# EAGLE design rotary-encoder-breakout-mk-1.0 (EAGLE 6.5.0)
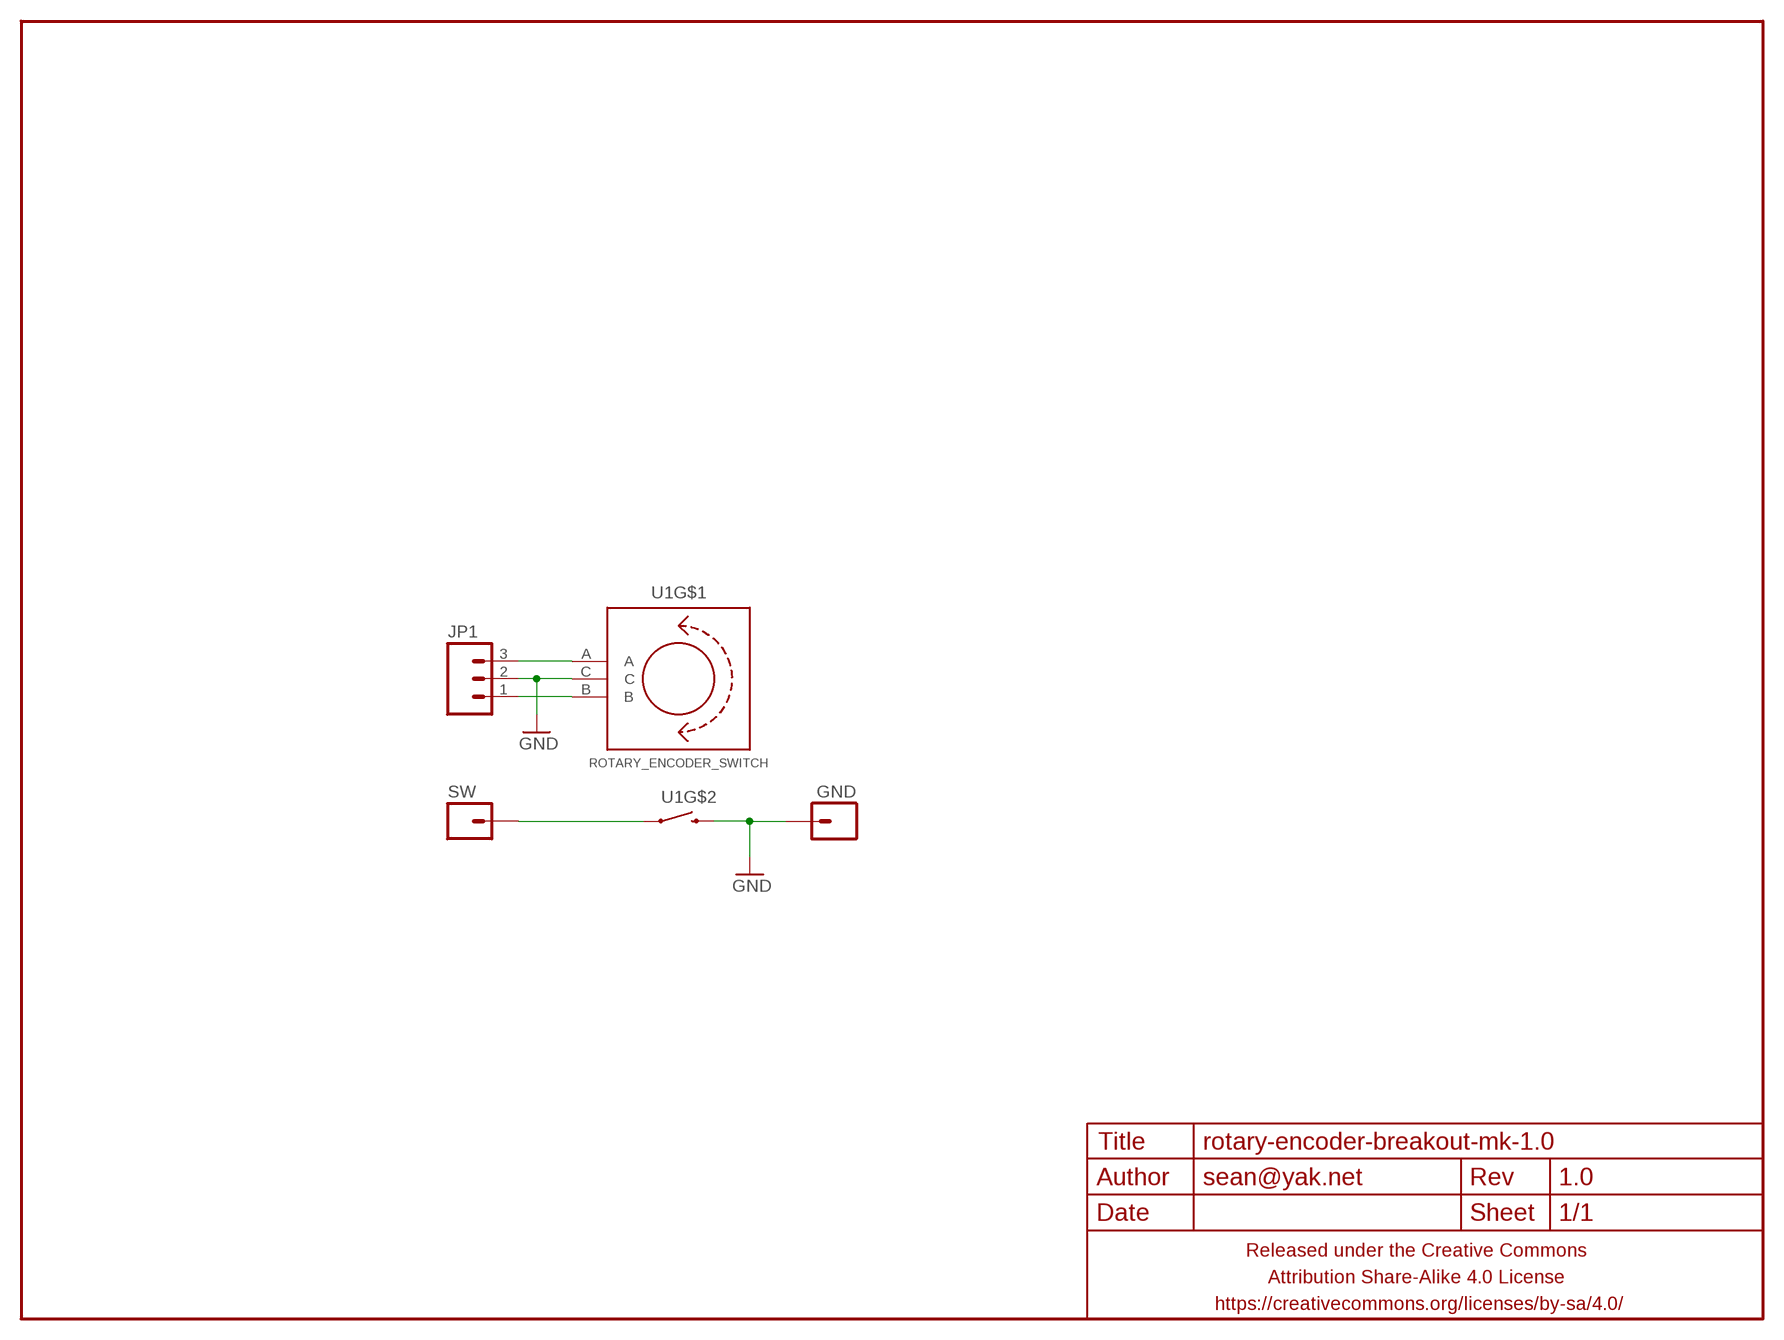
[diagram p0: schematic, sheet 1]

## Parts
FRAME1  FRAME-LETTERNO_PACKAGE  [DUMMY]
GND  M01PTH  [1X01]
JP1  M03PTH  [1X03]
SW  M01PTH  [1X01]
U1  ROTARY_ENCODER_SWITCH  [ROTARY_ENCODER_SWITCH]

## Nets
GND: GND.1 JP1.2 U1.C U1.SW2
N$1: JP1.3 U1.A
N$2: JP1.1 U1.B
SW1: SW.1 U1.SW1

## Library data of the parts
FRAME1 = A_butts:FRAME-LETTER: Schematic Frame Standard 8.5x11 US Letter frame; DESIGNER: sean@yak.net; VERSION: 1.0
GND SW = A_butts:M01: Header 1 Standard 1-pin 0.1" header. Use with straight break away headers (SKU : PRT-00116), right angle break away headers (PRT-00553), swiss pins (PRT-00743), machine pins (PRT-00117), and female headers (PRT-00115).
JP1 = A_butts:M03: Header 3 Standard 3-pin 0.1" header. Use with straight break away headers (SKU : PRT-00116), right angle break away headers (PRT-00553), swiss pins (PRT-00743), machine pins (PRT-00117), and female headers (PRT-00115). Molex polarized connector foot print use with SKU : PRT-08232 with associated crimp pins and housings.
U1 = A_butts:ROTARY_ENCODER_SWITCH

## Board
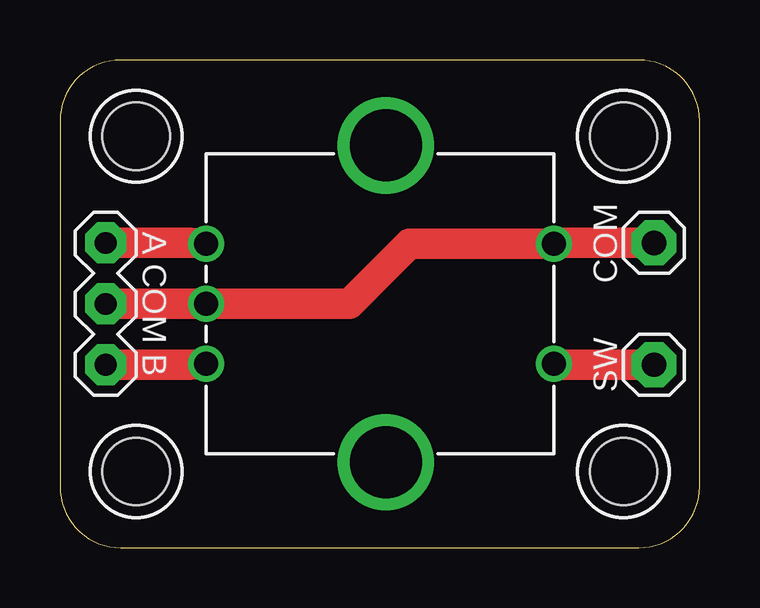
[diagram p1: board, top side]

Size 26.67 x 20.32 mm. Coordinates in mm from the lower left corner, seen from the top.
Outline: 0,17.78 0,2.54 arc90 2.54,0 24.13,0 arc90 26.67,2.54 26.67,17.78 arc90 24.13,20.32 2.54,20.32 arc90 0,17.78
Copper layers (1*16): Top 0.0356mm / dielectric 1.5011mm / Bottom 0.0356mm
Design rules "LaenPCBOrder2": minimum track width 6mil, minimum drill 13mil, track to track 6mil, track to pad 6mil, pad to pad 6mil, via to via 6mil, smd to smd 6mil, copper to edge 15mil, drill to drill 6mil, minimum pad ring 7mil, minimum via ring 7mil, stop-mask expansion 3mil, vias tented up to drill 20mil, thermal gap 10mil
Holes 2.8 mm at 3.17,17.14 23.5,3.17 23.5,17.14 3.17,3.17

### Footprints (pad centres in the part's own frame; a part is rotated, then mirrored left to right if it is on the bottom)
1X01 = drill 1.016 pad 1.88 octagon: 1 0,0
1X03 = drill 0.9 pad 1.7 octagon: 1 0,0; 2 2.54,0; 3 5.08,0
ROTARY_ENCODER_SWITCH = drill 1 pad 1.5: A 7.25,-2.5; B 7.25,2.5; C 7.25,0; SW1 -7.25,2.5; SW2 -7.25,-2.5 | drill 3: P$6 -0.25,6.6; P$7 -0.25,-6.6

### Placement (x,y rotation side)
FRAME1  0,0 0 top
GND  24.77,12.7 0 top
JP1  1.91,7.62 90 top
SW  24.77,7.62 0 top
U1  13.34,10.16 180 top

### Tracks (layer width: path | path; a pad name or v marks a point on that pad's centre or on a via)
GND
  Top 1.27: JP1.2 U1.C 12.06,10.16 14.56,12.66 U1.SW2 20.62,12.7 GND.1
N$1
  Top 1.27: JP1.3 5.41,12.7 U1.A
N$2
  Top 1.27: JP1.1 5.41,7.62 U1.B
SW1
  Top 1.27: SW.1 20.62,7.62 U1.SW1

### Text on the board
tPlace: A | COM | COM | B | SW